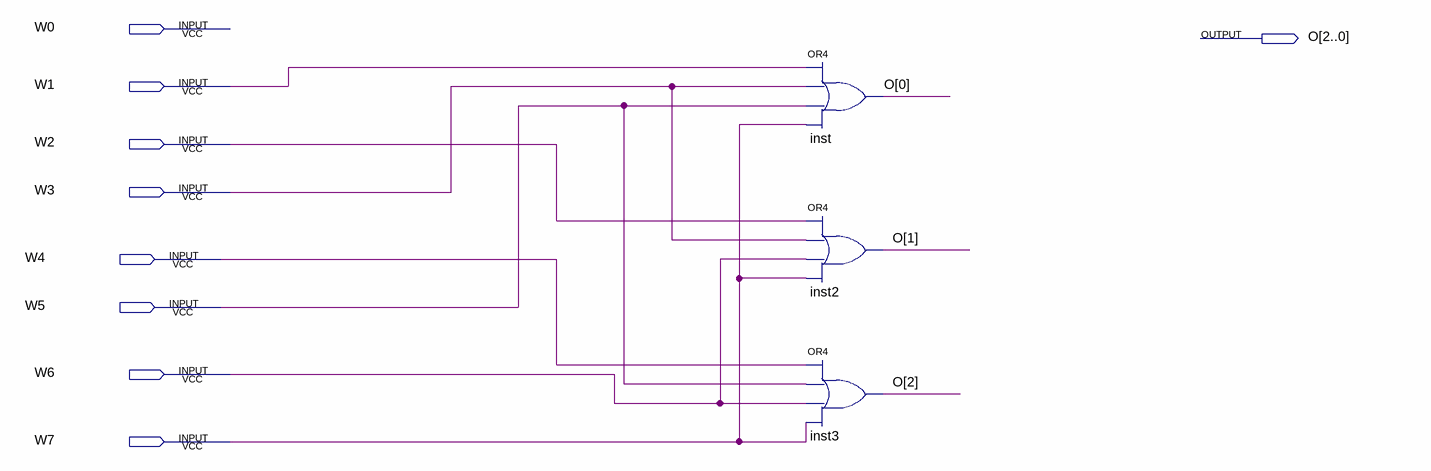
[diagram p0: schematic sheet]
// Quartus schematic Encoder8to3.bdf as structural Verilog: 3 symbols, 9 pins
module Encoder8to3 (
  input  W0,
  input  W1,
  input  W2,
  input  W3,
  input  W4,
  input  W5,
  input  W6,
  input  W7,
  output [2:0] O
);

  or inst (O[0], W1, W3, W5, W7);
  or inst2 (O[1], W2, W3, W6, W7);
  or inst3 (O[2], W4, W5, W6, W7);
endmodule
